# EAGLE design Arduino-Esplora-06 (EAGLE 6.4)
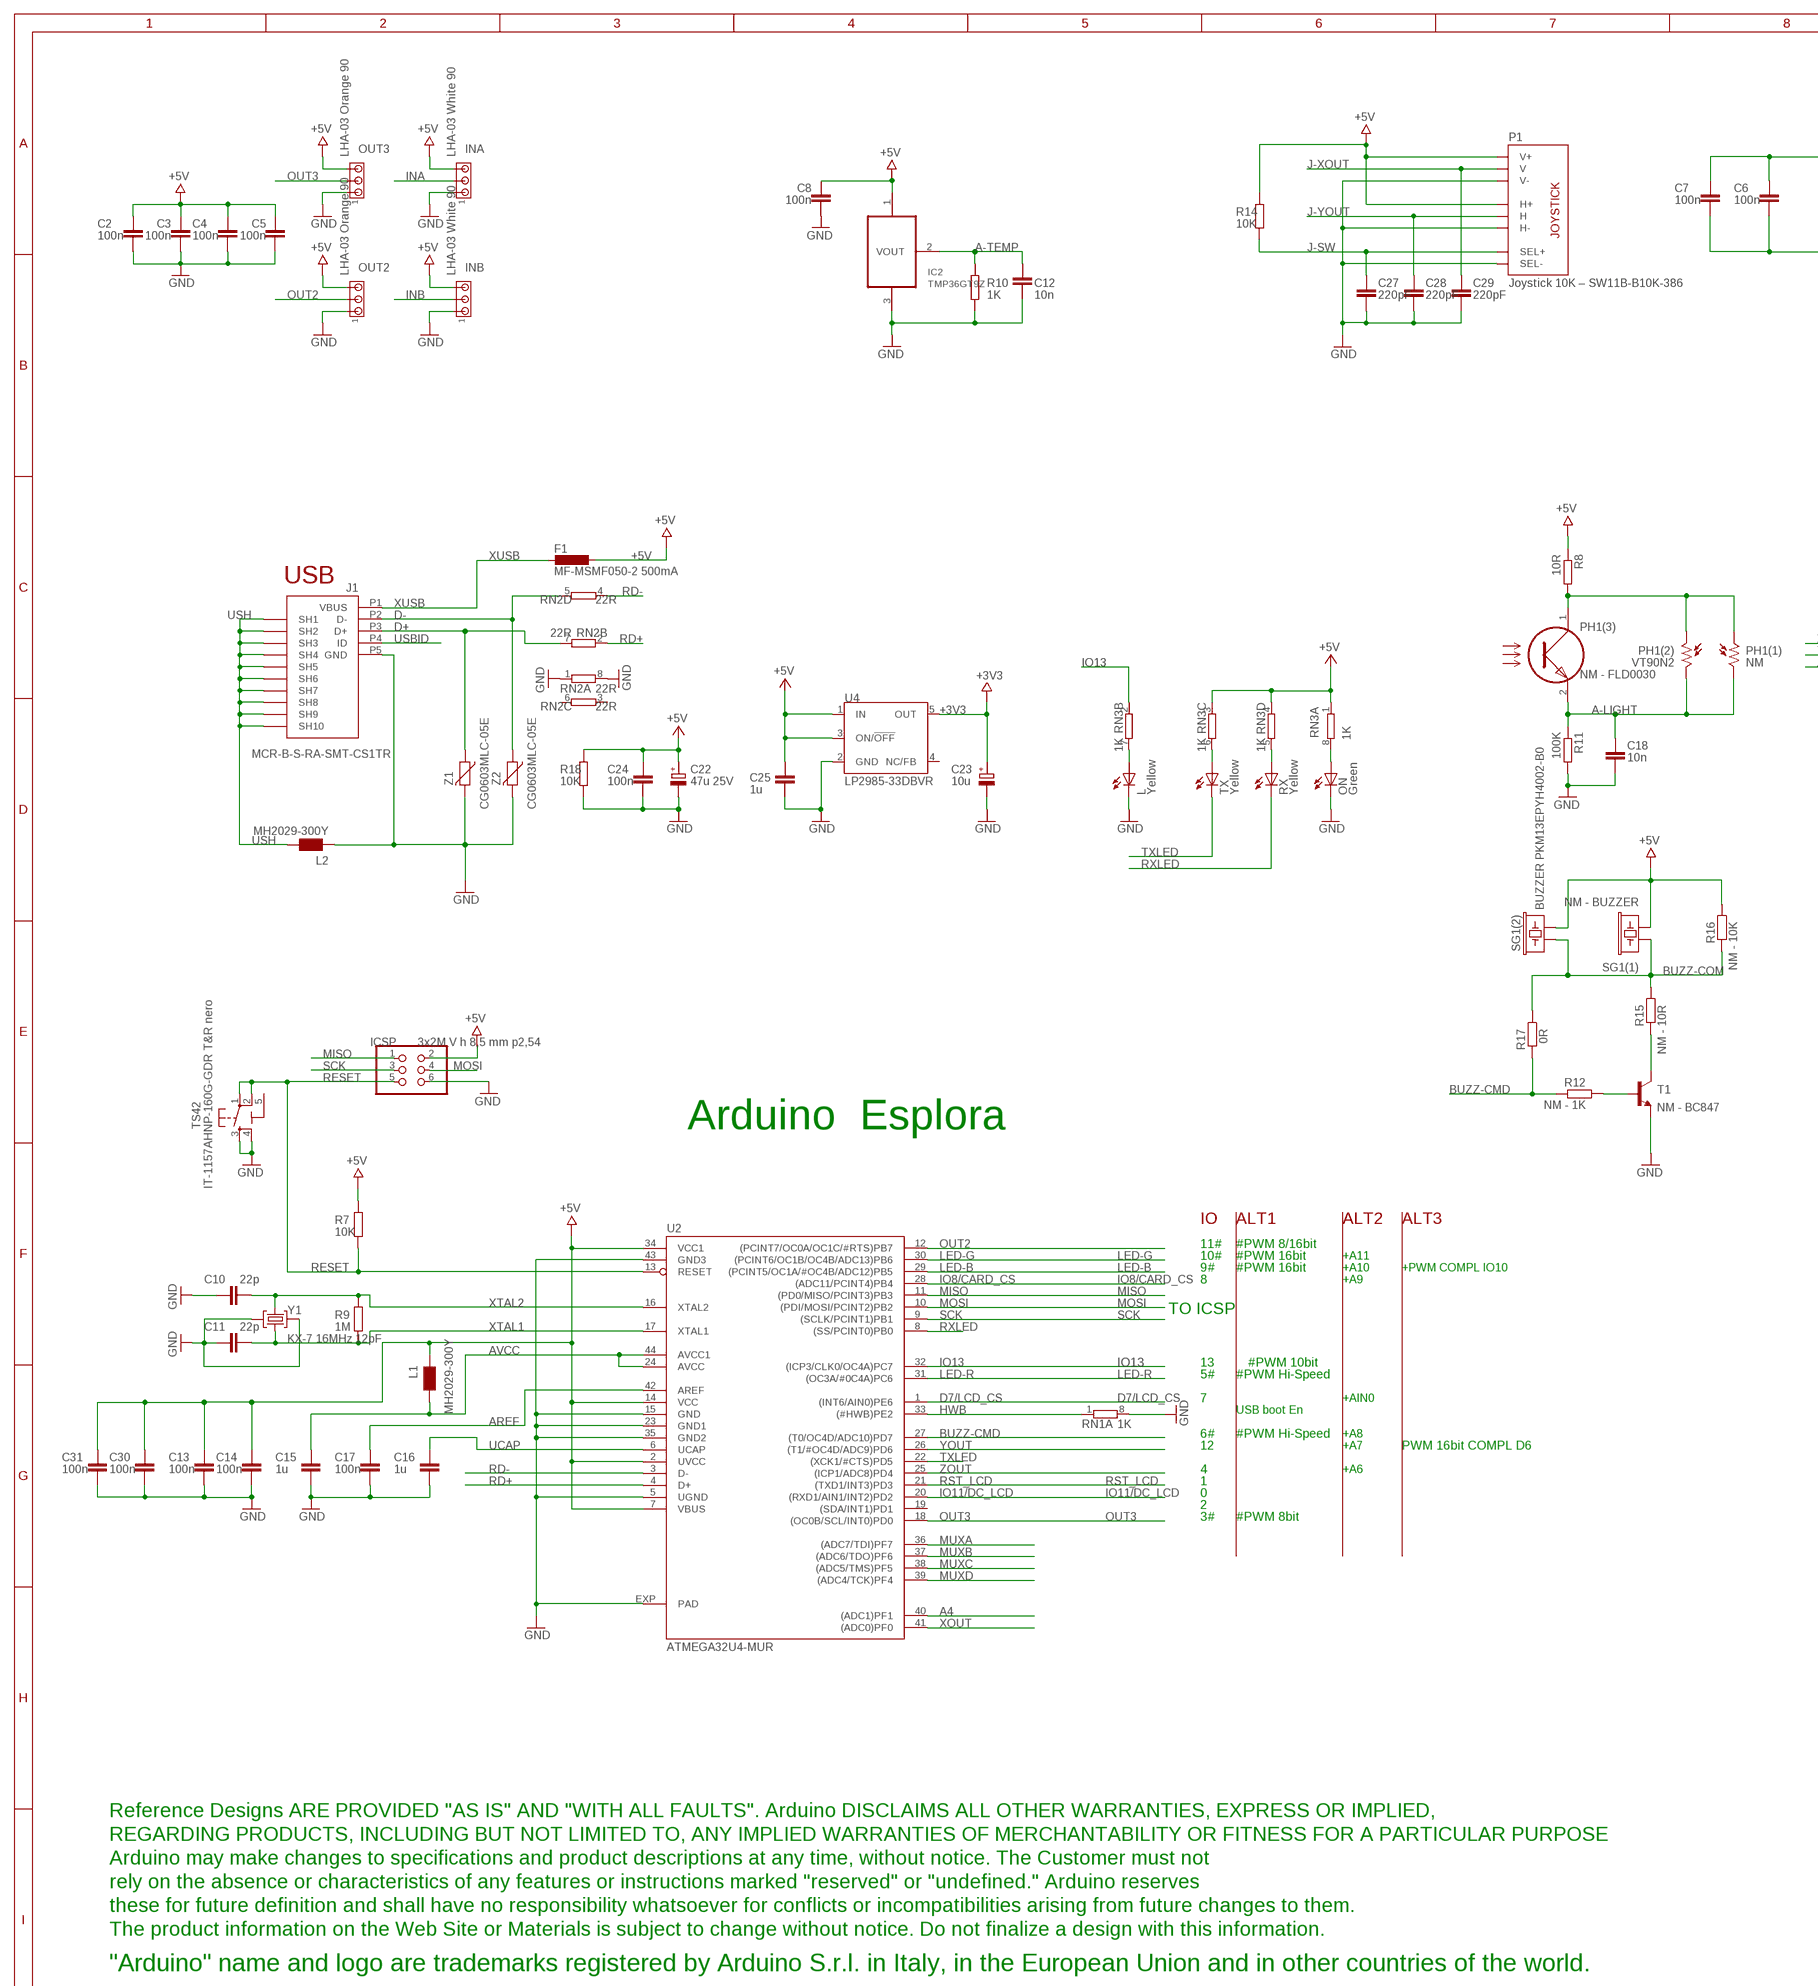
[diagram p0: schematic, sheet 1, part 1 of 2]
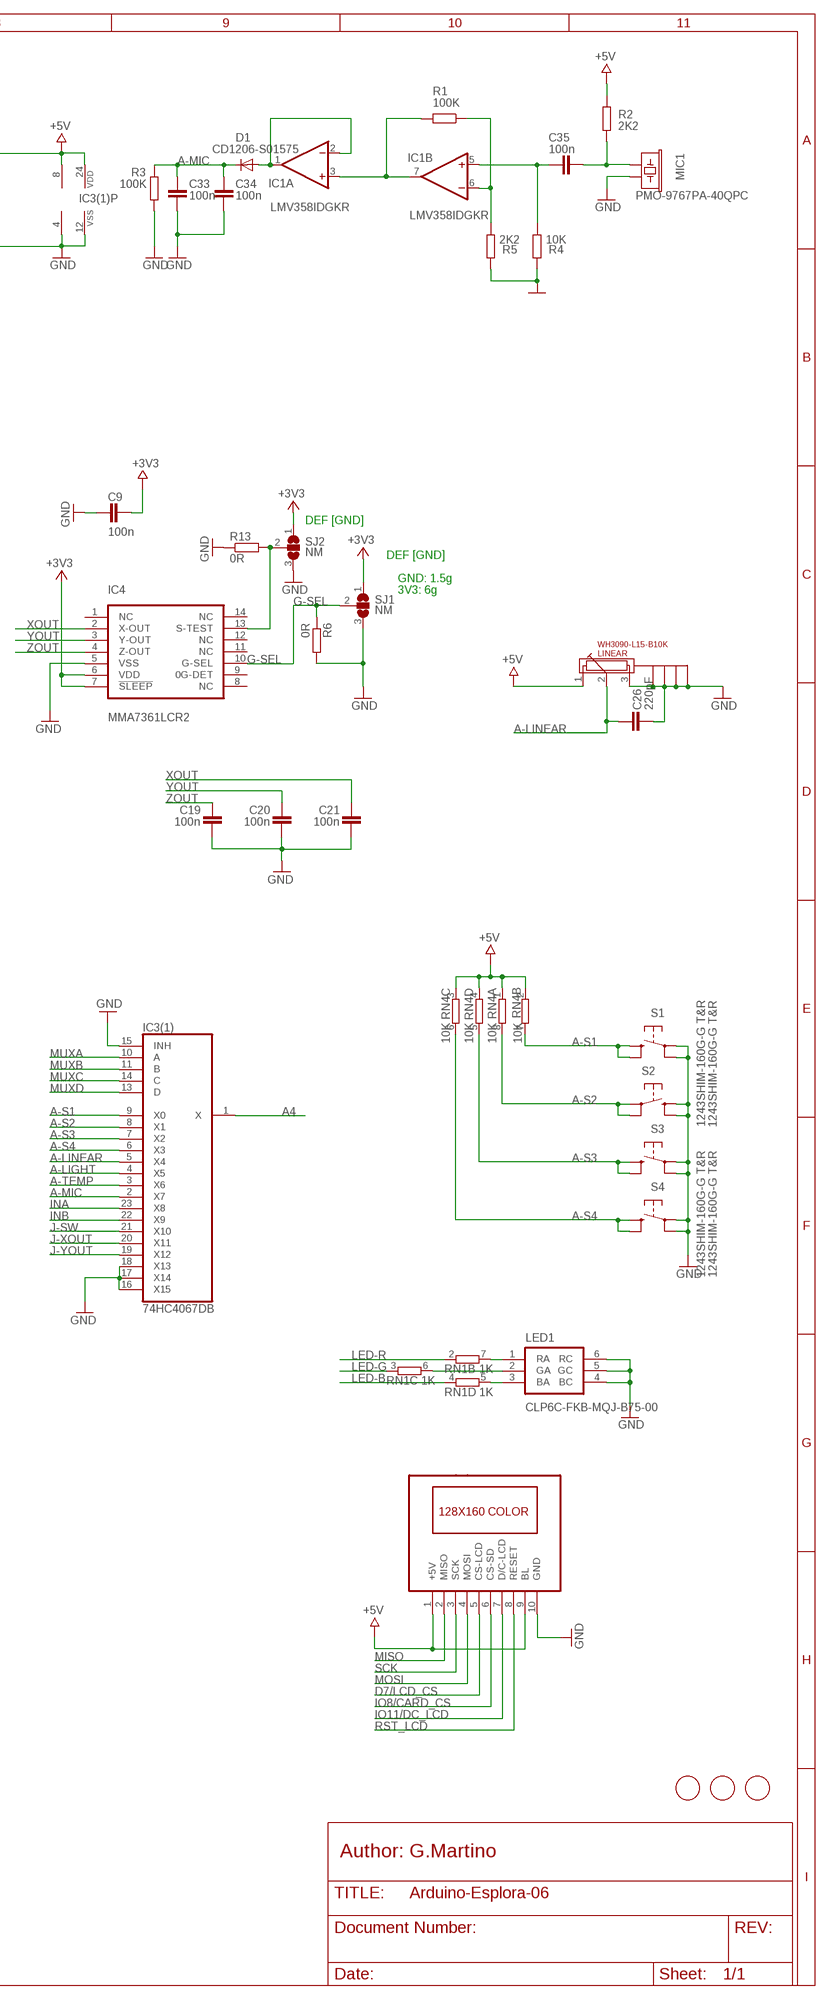
[diagram p1: schematic, sheet 1, part 2 of 2]

## Parts
C2  100n  C-EUC0603  [C0603-ROUND]
C3  100n  C-EUC0603  [C0603-ROUND]
C4  100n  C-EUC0603  [C0603-ROUND]
C5  100n  C-EUC0603  [C0603-ROUND]
C6  100n  C-EUC0603  [C0603-ROUND]
C7  100n  C-EUC0603  [C0603-ROUND]
C8  100n  C-EUC0603  [C0603-ROUND]
C9  100n  C-EUC0603  [C0603-ROUND]
C10  22p  C-EUC0603  [C0603-ROUND]
C11  22p  C-EUC0603  [C0603-ROUND]
C12  10n  C-EUC0603  [C0603-ROUND]
C13  100n  C-EUC0603  [C0603-ROUND]
C14  100n  C-EUC0603  [C0603-ROUND]
C15  1u  C-EUC0603  [C0603-ROUND]
C16  1u  C-EUC0603  [C0603-ROUND]
C17  100n  C-EUC0603  [C0603-ROUND]
C18  10n  C-EUC0603  [C0603-ROUND]
C19  100n  C-EUC0603  [C0603-ROUND]
C20  100n  C-EUC0603  [C0603-ROUND]
C21  100n  C-EUC0603  [C0603-ROUND]
C22  47u 25V  CPOL-EUD  [PANASONIC_D]
C23  10u  CPOL-EUSMCB  [SMC_B]
C24  100n  C-EUC0603  [C0603-ROUND]
C25  1u  C-EUC0603  [C0603-ROUND]
C26  220pF  C-EUC0603  [C0603-ROUND]
C27  220pF  C-EUC0603  [C0603-ROUND]
C28  220pF  C-EUC0603  [C0603-ROUND]
C29  220pF  C-EUC0603  [C0603-ROUND]
C30  100n  C-EUC0603  [C0603-ROUND]
C31  100n  C-EUC0603  [C0603-ROUND]
C33  100n  C-EUC0603  [C0603-ROUND]
C34  100n  C-EUC0603  [C0603-ROUND]
C35  100n  C-EUC0603  [C0603-ROUND]
D1  CD1206-S01575  DIODE-MINIMELF  [MINIMELF]
F1  MF-MSMF050-2 500mA  L-EUL1812  [L1812]
FID1  FIDUCIALMOUNT  [FIDUCIA-MOUNT]
FID2  FIDUCIALMOUNT  [FIDUCIA-MOUNT]
FID3  FIDUCIALMOUNT  [FIDUCIA-MOUNT]
IC1  LMV358IDGKR  LMV358MMX  [MSOP08]
IC2  TMP36GT9Z  LM35TO-92  [TO92]
IC3(1)  74HC4067DB  4067SM96  [SSOP24(0.65)]
IC4  MMA7361LCR2  MMA7361LC  [LGA-14_3X5/0.8]
ICSP  3x2M V h 8,5 mm p2,54  PINHD-2X3  [2X03]
INA  LHA-03 White 90  MTA03-100  [10X03MTA]
INB  LHA-03 White 90  MTA03-100  [10X03MTA]
J1  MCR-B-S-RA-SMT-CS1TR  MYCON2_USB-MINI-B  [CON2_USB_MICRO_B_AT]
L  Yellow  LEDCHIPLED_0805  [CHIPLED_0805]
L1  MH2029-300Y  WE-CBF_0805  [0805]
L2  MH2029-300Y  WE-CBF_0805  [0805]
LCD1  LCD1  1.8'_LCD-TFT(128X160)+SD-CARD  [1.8'_LCD-LCD-TFT(128X160)]
LED1  CLP6C-FKB-MQJ-B75-00  RGB-LED  [RGB-LED]
LINEAR  WH3090-L15-B10K  RA3021-202  [RA3021-202]
MIC1  PMO-9767PA-40QPC  MIC9.7MM  [MIC-9.7MM]
ON  Green  LEDCHIPLED_0805  [CHIPLED_0805]
OUT2  LHA-03 Orange 90  MTA03-100  [10X03MTA]
OUT3  LHA-03 Orange 90  MTA03-100  [10X03MTA]
P1  Joystick 10K – SW11B-B10K-386  ALP_JOYSTICKPTH  [ALP_JOYSTICK]
PH1(1)  NM  A1050_09  [T0-46-A10XX]
PH1(2)  VT90N2  B1060_23  [TO-8_B10]
PH1(3)  NM - FLD0030  FLD00030  [FLD00030]
R1  100K  R-EU_R0603  [R0603-ROUND]
R2  2K2  R-EU_R0603  [R0603-ROUND]
R3  100K  R-EU_R0603  [R0603-ROUND]
R4  10K  R-EU_R0603  [R0603-ROUND]
R5  2K2  R-EU_R0603  [R0603-ROUND]
R6  0R  R-EU_R0603  [R0603-ROUND]
R7  10K  R-EU_R0603  [R0603-ROUND]
R8  10R  R-EU_R0603  [R0603-ROUND]
R9  1M  R-EU_R0603  [R0603-ROUND]
R10  1K  R-EU_R0603  [R0603-ROUND]
R11  100K  R-EU_R0603  [R0603-ROUND]
R12  NM - 1K  R-EU_R0603  [R0603-ROUND]
R13  0R  R-EU_R0603  [R0603-ROUND]
R14  10K  R-EU_R0603  [R0603-ROUND]
R15  NM - 10R  R-EU_R0603  [R0603-ROUND]
R16  NM - 10K  R-EU_R0603  [R0603-ROUND]
R17  0R  R-EU_R0603  [R0603-ROUND]
R18  10K  R-EU_R0603  [R0603-ROUND]
RN1  1K  4R-NCAY16  [CAY16]
RN2  22R  4R-NCAY16  [CAY16]
RN3  1K  4R-NCAY16  [CAY16]
RN4  10K  4R-NCAY16  [CAY16]
RX  Yellow  LEDCHIPLED_0805  [CHIPLED_0805]
S1  1243SHIM-160G-G T&R  TACTILE_SWITCHTACTILE_SWITCH_SMD-12MM  [TACTILE-SMD-12MM]
S2  1243SHIM-160G-G T&R  TACTILE_SWITCHTACTILE_SWITCH_SMD-12MM  [TACTILE-SMD-12MM]
S3  1243SHIM-160G-G T&R  TACTILE_SWITCHTACTILE_SWITCH_SMD-12MM  [TACTILE-SMD-12MM]
S4  1243SHIM-160G-G T&R  TACTILE_SWITCHTACTILE_SWITCH_SMD-12MM  [TACTILE-SMD-12MM]
SG1(1)  NM - BUZZER  BUZZER1NS  [BUZZER-12MM-NS-P5MM]
SG1(2)  BUZZER PKM13EPYH4002-B0  BUZZER1PTH-NS-KIT  [BUZZER-12MM-NS-KIT]
SJ1  NM  SJ2W  [SJ_2]
SJ2  NM  SJ2W  [SJ_2]
T1  NM - BC847  BC847  [SOT23]
TS42  IT-1157AHNP-160G-GDR T&R nero  TS42  [TS42]
TX  Yellow  LEDCHIPLED_0805  [CHIPLED_0805]
U2  ATMEGA32U4-MUR  ATMEGA32U4-MU  [QFN44ML7X7]
U4  LP2985-33DBVR  LP2985-XXDBVR33  [SOT23-DBV]
U$19  DISCLAIMER  [DISCLAIMER]
Y1  KX-7 16MHz 12pF  CRYSTAL-3.2-2.5  [CRYSTAL-3.2-2.5]
Z1  CG0603MLC-05E  VARISTORCN0603  [CT/CN0603]
Z2  CG0603MLC-05E  VARISTORCN0603  [CT/CN0603]

## Nets
+3V3 [power]: C9.2 C23.+ IC4.6(VDD) IC4.7(!SLEEP) SJ1.1 SJ2.1 U4.5(OUT)
+5V [power]: C2.2 C3.2 C4.2 C5.2 C6.2 C7.2 C8.2 C13.1 C14.1 C22.+ C24.2 C25.2 C30.1 C31.1 F1.1 IC1.8(P:V+) IC2.1(+VS) IC3(1).24(VDD) ICSP.2 INA.3 INB.3 L1.1 LCD1.1(+5V) LCD1.9(BL) LINEAR.1 OUT2.3 OUT3.3 P1.H1(H+) P1.V1(V+) R2.1 R7.1 R8.1 R14.1 R16.1 R18.1 RN3.1 RN3.3 RN3.4 RN4.1 RN4.2 RN4.3 RN4.4 SG1(1).- SG1(2).- U2.2(UVCC) U2.7(VBUS) U2.14(VCC) U2.34(VCC1) U4.1(IN) U4.3(ON/!OFF)
A4: IC3(1).1(X) U2.40((ADC1)PF1)
A-LIGHT: C18.2 IC3(1).4(X5) PH1(1).2 PH1(2).2 PH1(3).2 R11.1
A-LINEAR: C26.2 IC3(1).5(X4) LINEAR.2
A-MIC: C33.2 C34.2 D1.C IC3(1).2(X7) R3.1
A-S1: IC3(1).9(X0) RN4.7 S1.P$3 S1.P$4
A-S2: IC3(1).8(X1) RN4.8 S2.P$1 S2.P$2
A-S3: IC3(1).7(X2) RN4.5 S3.P$3 S3.P$4
A-S4: IC3(1).6(X3) RN4.6 S4.P$3 S4.P$4
A-TEMP: C12.2 IC2.2(VOUT) IC3(1).3(X6) R10.1
AREF [aref]: C17.2 U2.42(AREF)
AVCC: C15.1 L1.2 U2.24(AVCC) U2.44(AVCC1)
BUZZ-CMD: R12.2 R17.2 U2.27((T0/OC4D/ADC10)PD7)
BUZZ-COM: R15.1 R16.2 R17.1 SG1(1).+ SG1(2).+
D7/LCD_CS: LCD1.5(CS-LCD) U2.1((INT6/AIN0)PE6)
D+: J1.P3(D+) RN2.7 Z1.1
D-: J1.P2(D-) RN2.5 Z2.1
G-SEL: IC4.10(G-SEL) R6.1 SJ1.2
GND [gnd]: C2.1 C3.1 C4.1 C5.1 C6.1 C7.1 C8.1 C9.1 C10.1 C11.2 C12.1 C13.2 C14.2 C15.2 C16.2 C17.1 C18.1 C19.1 C20.1 C21.1 C22.- C23.- C24.1 C25.1 C26.1 C27.1 C28.1 C29.1 C30.2 C31.2 C33.1 C34.1 IC1.4(P:V-) IC2.3(GND) IC3(1).12(VSS) IC3(1).15(INH) IC3(1).16(X15) IC3(1).17(X14) IC3(1).18(X13) IC4.5(VSS) ICSP.6 INA.1 INB.1 J1.P5(GND) L2.1 L.C LCD1.10(GND) LED1.4(BC) LED1.5(GC) LED1.6(RC) LINEAR.3 LINEAR.CHASSIS1(CHASSIS-GND-1) LINEAR.CHASSIS2(CHASSIS-GND-2) LINEAR.CHASSIS3(CHASSIS-GND-3) LINEAR.CHASSIS4(CHASSIS-GND-4) MIC1.2 ON.C OUT2.1 OUT3.1 P1.B2A(SEL-) P1.H3(H-) P1.V3(V-) R3.2 R4.2 R5.2 R6.2 R10.2 R11.2 R13.1 R18.2 RN1.8 RN2.1 RN2.8 S1.P$1 S1.P$2 S2.P$3 S2.P$4 S3.P$1 S3.P$2 S4.P$1 S4.P$2 SJ1.3 SJ2.3 T1.2(E) TS42.3 TS42.4 U2.5(UGND) U2.15(GND) U2.23(GND1) U2.35(GND2) U2.43(GND3) U2.EXP(PAD) U4.2(GND) Y1.2(GND) Y1.4(GND) Z1.2 Z2.2
HWB: RN1.1 U2.33((#HWB)PE2)
INA: IC3(1).23(X8) INA.2
INB: IC3(1).22(X9) INB.2
IO8/CARD_CS: LCD1.6(CS-SD) U2.28((ADC11/PCINT4)PB4)
IO11/DC_LCD: LCD1.7(D/C-LCD) U2.20((RXD1/AIN1/INT2)PD2)
IO13: RN3.2 U2.32((ICP3/CLK0/OC4A)PC7)
J-SW: C27.2 IC3(1).21(X10) P1.B1A(SEL+) R14.2
J-XOUT: C29.2 IC3(1).20(X11) P1.V2(V)
J-YOUT: C28.2 IC3(1).19(X12) P1.H2(H)
LED-B: RN1.4 U2.29((PCINT5/OC1A/#OC4B/ADC12)PB5)
LED-G: RN1.3 U2.30((PCINT6/OC1B/OC4B/ADC13)PB6)
LED-R: RN1.2 U2.31((OC3A/#0C4A)PC6)
MISO: ICSP.1 LCD1.2(MISO) U2.11((PD0/MISO/PCINT3)PB3)
MOSI: ICSP.4 LCD1.4(MOSI) U2.10((PDI/MOSI/PCINT2)PB2)
MUXA: IC3(1).10(A) U2.36((ADC7/TDI)PF7)
MUXB: IC3(1).11(B) U2.37((ADC6/TDO)PF6)
MUXC: IC3(1).14(C) U2.38((ADC5/TMS)PF5)
MUXD: IC3(1).13(D) U2.39((ADC4/TCK)PF4)
N$1: D1.A IC1.1(A:OUT) IC1.2(A:-IN)
N$2: L.A RN3.7
N$3: ON.A RN3.8
N$4: IC4.13(S-TEST) R13.2 SJ2.2
N$5: R15.2 T1.3(C)
N$6: RN3.6 TX.A
N$8: RN3.5 RX.A
N$11: LED1.1(RA) RN1.7
N$12: LED1.2(GA) RN1.6
N$13: LED1.3(BA) RN1.5
N$19: C35.1 MIC1.1 R2.2
N$20: C35.2 IC1.5(B:+IN) R4.1
N$21: IC1.6(B:-IN) R1.1 R5.1
N$23: IC1.3(A:+IN) IC1.7(B:OUT) R1.2
N$27: PH1(1).1 PH1(2).1 PH1(3).1 R8.2
N$31: R12.1 T1.1(B)
OUT2: OUT2.2 U2.12((PCINT7/OC0A/OC1C/#RTS)PB7)
OUT3: OUT3.2 U2.18((OC0B/SCL/INT0)PD0)
RD+: RN2.2 U2.4(D+)
RD-: RN2.4 U2.3(D-)
RESET: ICSP.5 R7.2 TS42.1 TS42.2 U2.13(RESET)
RST_LCD: LCD1.8(RESET) U2.21((TXD1/INT3)PD3)
RXLED: RX.C U2.8((SS/PCINT0)PB0)
SCK: ICSP.3 LCD1.3(SCK) U2.9((SCLK/PCINT1)PB1)
TXLED: TX.C U2.22((XCK1/#CTS)PD5)
UCAP: C16.1 U2.6(UCAP)
USBID: J1.P4(ID)
USH [gnd]: J1.P$1(SH7) J1.P$2(SH8) J1.P$3(SH9) J1.P$4(SH10) J1.P$5(SH7) J1.P$6(SH8) J1.P$7(SH9) J1.P$8(SH10) J1.S1(SH1) J1.S2(SH2) J1.S3(SH3) J1.S4(SH4) J1.S5(SH5) J1.S6(SH6) L2.2
XOUT: C21.2 IC4.2(X-OUT) U2.41((ADC0)PF0)
XTAL1: C11.1 R9.1 U2.17(XTAL1) Y1.1(C1)
XTAL2: C10.2 R9.2 U2.16(XTAL2) Y1.3(C2)
XUSB [usbvcc]: F1.2 J1.P1(VBUS)
YOUT: C20.2 IC4.3(Y-OUT) U2.26((T1/#OC4D/ADC9)PD6)
ZOUT: C19.2 IC4.4(Z-OUT) U2.25((ICP1/ADC8)PD4)
Unconnected: IC4.1(NC) IC4.8(NC) IC4.9(0G-DET) IC4.11(NC) IC4.12(NC) IC4.14(NC) RN2.3 RN2.6 U2.19((SDA/INT1)PD1) U4.4(NC/FB)

## Notes on the sheet
- DEF [GND]
- DEF [GND]
- USB
- GND: 1.5g
- 3V3: 6g
- Arduino  Esplora
- IO | ALT1 | ALT2 | ALT3
- 11# | #PWM 8/16bit
- 10# | #PWM 16bit | +A11
- 9# | #PWM 16bit | +A10 | +PWM COMPL IO10
- 8 | +A9
- TO ICSP
- 13 | #PWM 10bit
- 5# | #PWM Hi-Speed
- 7 | +AIN0
- USB boot En
- 6# | #PWM Hi-Speed | +A8
- 12 | +A7 | PWM 16bit COMPL D6
- 4 | +A6
- 1
- 0
- 2
- 3# | #PWM 8bit
- Author: G.Martino

## Power pins joined to a net without a drawn wire
5-GND: TS42.5(5-GND)

## Library data of the parts
C2-C21 C24-C31 C33-C35 = SmartPrj:C-EU: CAPACITOR, European symbol
C22 C23 = rcl:CPOL-EU: POLARIZED CAPACITOR, European symbol
D1 = diode:DIODE-: DIODE
F1 = rcl:L-EU: INDUCTOR, European symbol
FID1-FID3 = SmartPrj:FIDUCIALMOUNT
IC1 = linear:LMV358?*: Dual General Purpose, Low Voltage, Rail-to-Rail Output Operational Amplifiers Source: http://www.national.com/mpf/LM/LMV321.html http://www.national.com/dt/lmv_qual.pdf
IC2 = SmartPrj:LM35: LM35 Precision Centigrade Temperature Sensors
IC3(1) = SmartPrj:4067: 16-channel ANALOG MULTIPLEXER
IC4 = SmartPrj:MMA7361LC: MMA7361LC Three Axis Accelerometer Freescale Semiconductor
ICSP = SmartPrj:PINHD-2X3: PIN HEADER
INA INB OUT2 OUT3 = con-amp:MTA03-100: AMP connector
J1 = SmartPrj:MYCON2_USB-MINI-B
L ON RX TX = led:LED: LED OSRAM: - CHIPLED LG R971, LG N971, LY N971, LG Q971, LY Q971, LO R971, LY R971 LH N974, LH R974 LS Q976, LO Q976, LY Q976 LO Q996 - Hyper CHIPLED LW Q18S LB Q993, LB Q99A, LB R99A - SideLED LS A670, LO A670, LY A670, LG A670, LP A670 LB A673, LV A673, LT A673, LW A673 LH A674 LY A675 LS A676, LA A676, LO A676, LY A676, LW A676 LS A679, LY A679, LG A679 - Hyper Micro SIDELED® LS Y876, LA Y876, LO Y876, LY Y876 LT Y87S - SmartLED LW L88C, LW L88S LB L89C, LB L89S, LG L890 LS L89K, LO L89K, LY L89K LS L896, LA L896, LO L896, LY L896 - TOPLED LS T670, LO T670, LY T670, LG T670, LP T670 LSG T670, LSP T670, LSY T670, LOP T670, LYG T670 LG T671, LOG T671, LSG T671 LB T673, LV T673, LT T673, LW T673 LH T674 LS T676, LA T676, LO T676, LY T676, LB T676, LH T676, LSB T676, LW T676 LB T67C, LV T67C, LT T67C, LS T67K, LO T67K, LY T67K, LW E67C LS E67B, LA E67B, LO E67B, LY E67B, LB E67C, LV E67C, LT E67C LW T67C LS T679, LY T679, LG T679 LS T770, LO T770, LY T770, LG T770, LP T770 LB T773, LV T773, LT T773, LW T773 LH T774 LS E675, LA E675, LY E675, LS T675 LS T776, LA T776, LO T776, LY T776, LB T776 LHGB T686 LT T68C, LB T68C - Hyper Mini TOPLED® LB M676 - Mini TOPLED Santana® LG M470 LS M47K, LO M47K, LY M47K Source: http://www.osram.convergy.de LUXEON: - LUMILED® LXK2-PW12-R00, LXK2-PW12-S00, LXK2-PW14-U00, LXK2-PW14-V00 LXK2-PM12-R00, LXK2-PM12-S00, LXK2-PM14-U00 LXK2-PE12-Q00, LXK2-PE12-R00, LXK2-PE12-S00, LXK2-PE14-T00, LXK2-PE14-U00 LXK2-PB12-K00, LXK2-PB12-L00, LXK2-PB12-M00, LXK2-PB14-N00, LXK2-PB14-P00, LXK2-PB14-Q00 LXK2-PR12-L00, LXK2-PR12-M00, LXK2-PR14-Q00, LXK2-PR14-R00 LXK2-PD12-Q00, LXK2-PD12-R00, LXK2-PD12-S00 LXK2-PH12-R00, LXK2-PH12-S00 LXK2-PL12-P00, LXK2-PL12-Q00, LXK2-PL12-R00 Source: www.luxeon.com KINGBRIGHT: KA-3528ASYC Source: www.kingbright.com
L1 L2 = wuerth-elektronik:WE-CBF: SMD EMI Suppression Ferrite Beads - excellent anti-EMI properties - low DCR - impedances till 3000 ohms - rated current up to 6 A
LCD1 = SmartPrj:1.8'_LCD-TFT(128X160)+SD-CARD: 1.8Inch LCD Display + SD Card SmartProjects.it
LED1 = SmartPrj:RGB-LED: CREE RGB-LED/PLCC6-SMD
LINEAR = st-mod v1.1:RA3021-202: RA3021-202 Linear Potentiometer P.C.B. single unit case-earthing mounting type Travel: 30mm
MIC1 = SparkFun:MIC: Microphone Omni-directional electret microphone. 9.7mm standard diameter.
P1 = SmartPrj:ALP_JOYSTICK: Thumb Joystick Joystick commonly found in PS2 controllers. Two pots and a select switch. Footprint proven. Spark Fun Electronics SKU : COM-09032
PH1(1) = photo-elements:A10: Sensor Robust Light Sensing Applications Outdoor Light Sensing Application Source: http://optoelectronics.perkinelmer.com/content/Datasheets/DTS_PhotocellsA1050.pdf
PH1(2) = photo-elements:?1060*: Sensor Street Light control Source: http://optoelectronics.perkinelmer.com/content/Datasheets/DTS_PhotocellsB1060.pdf
PH1(3) = SmartPrj:FLD00030: FLD00030 Analog Ambient Light Sensor FAIRCHILD Semiconductor
R1-R18 = SmartPrj:R-EU_: RESISTOR, European symbol
RN1-RN4 = resistor-dil:4R-N: Array Chip Resistor Source: RS Component / Phycomp
S1-S4 = SmartPrj:TACTILE_SWITCH: Momentary Switch Button commonly used for reset or general input.
SG1(1) SG1(2) = SmartPrj:BUZZER1: Buzzer 12-22mm Spark Fun Electronics SKU : Comp-Buzzer
SJ1 SJ2 = jumper:SJ2W: SMD solder JUMPER
T1 = transistor:BC847: NPN TRANSISTOR
TS42 = SmartPrj:TS42: TS42 Dongnan Electronics Tact switch VDC 12V - 50mA
U2 = SmartPrj:ATMEGA32U4-
U4 = SmartPrj:LP2985-XXDBVR: ULTRALOW-POWER 50-mA LOW-DROPOUT LINEAR REGULATORS 50-mA Low-Dropout Regulator Source: http://focus.ti.com/lit/ds/symlink/tps77001.pdf
U$19 = Misc:DISCLAIMER
Y1 = SmartPrj:CRYSTAL-3.2-2.5
Z1 Z2 = varistor:VARISTOR: VARISTOR

## Net classes
0 default: width 0.254 mm, drill 0.61 mm, clearance 0.254 mm
1 power: width 0.254 mm, drill 0.61 mm, clearance 0.254 mm
2 gnd: width 0.254 mm, drill 0.61 mm, clearance 0.254 mm
3 usbvcc: width 0.254 mm, drill 0.61 mm, clearance 0.254 mm
4 aref: width 0.254 mm, drill 0.61 mm, clearance 0.254 mm

## Board
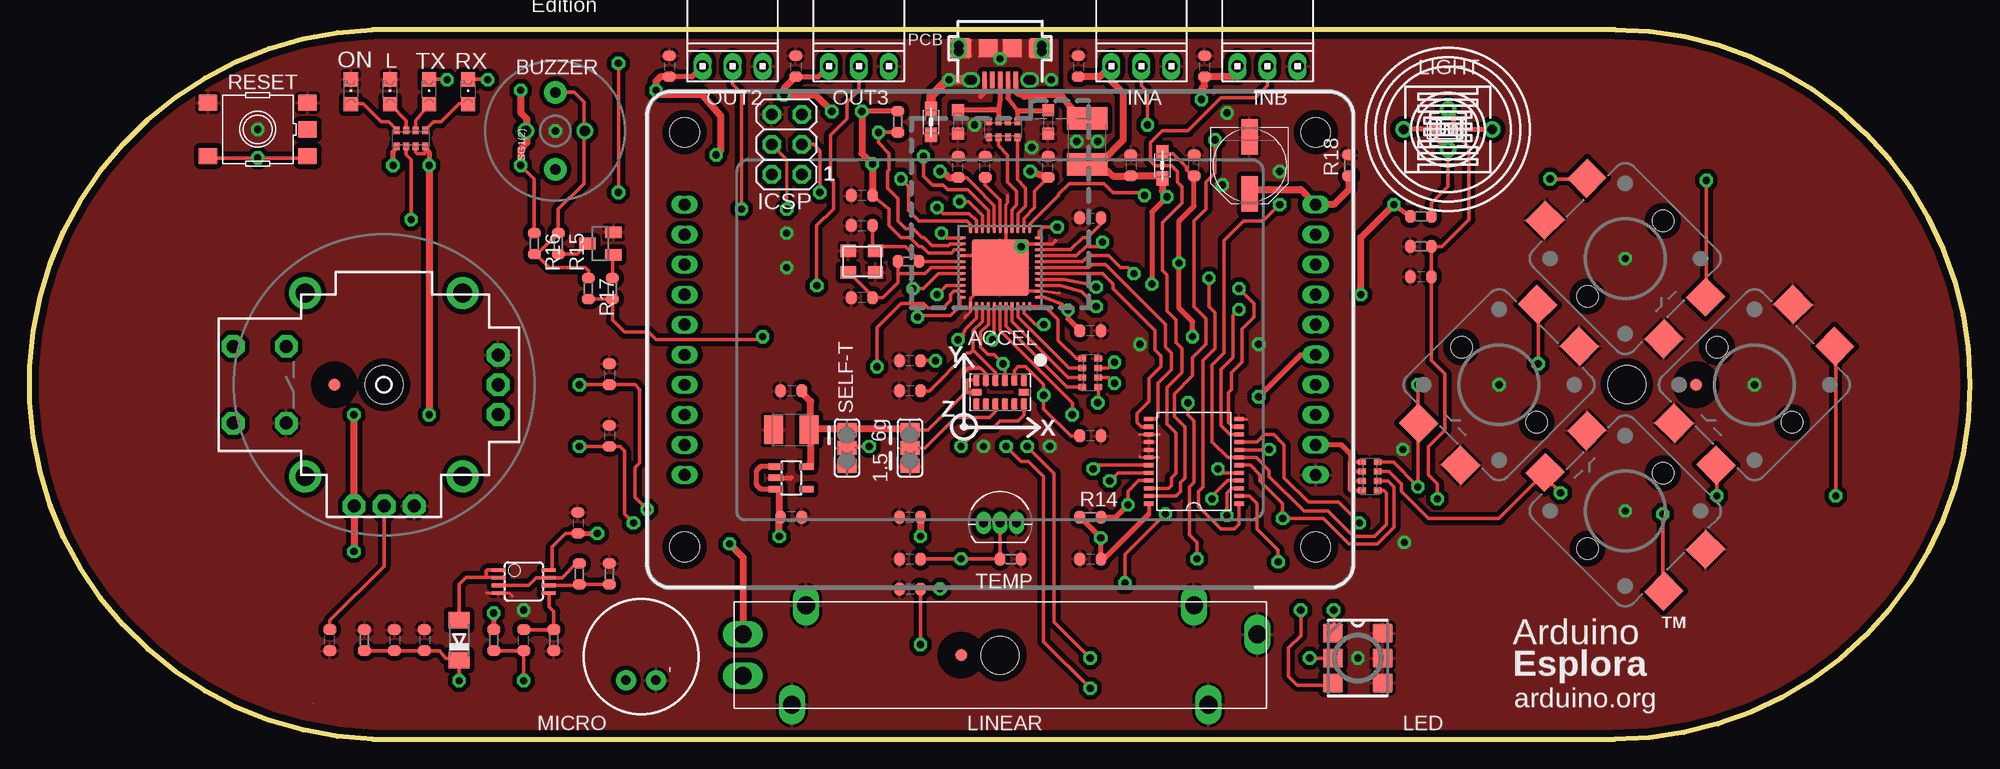
[diagram p2: board, top side]
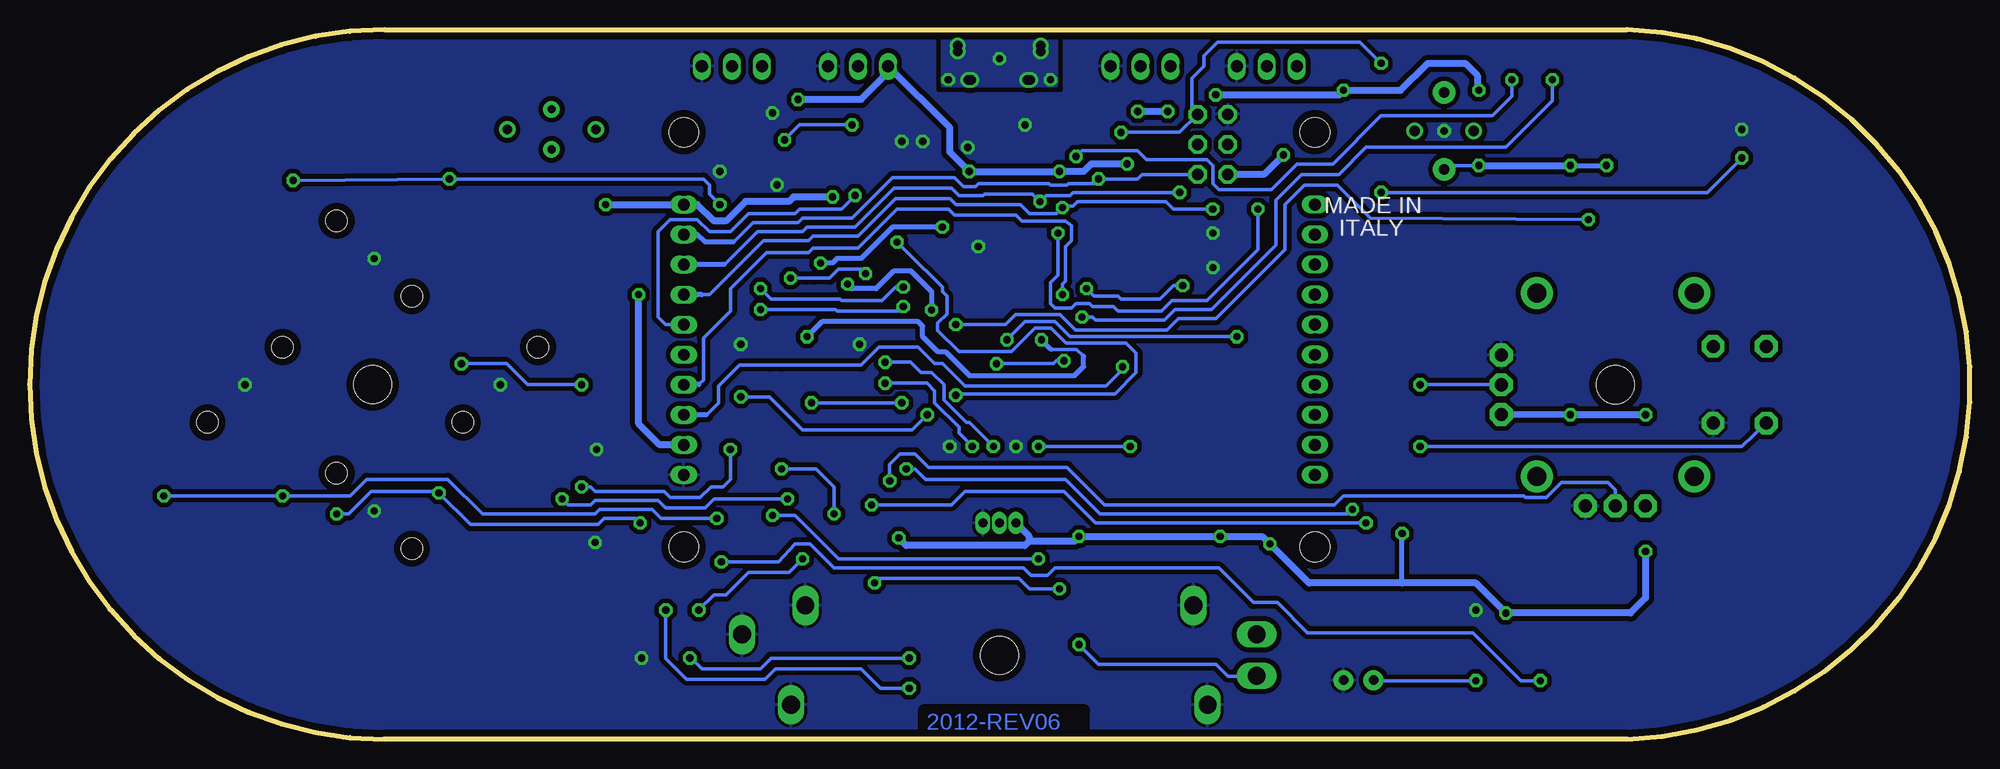
[diagram p3: board, bottom side, seen from below]

Size 163.98 x 60 mm. Coordinates in mm from the lower left corner, seen from the top.
Outline: 28.98,0 133.98,0 arc180 133.98,60 28.98,60 arc176 28.98,0
Copper layers (1*16): Top 0.035mm / dielectric 1.5mm / Bottom 0.035mm
Design rules "default": minimum track width 10mil, minimum drill 22mil, track to track 10mil, track to pad 10mil, pad to pad 8mil, via to via 12mil, smd to smd 8mil, copper to edge 24mil, drill to drill 12mil, minimum pad ring 10mil, minimum via ring 10mil, stop-mask expansion 2mil, vias tented up to drill 30mil, thermal gap 10mil
Holes 3.2 mm at 82.02,7.11 29.95,29.97 134.98,30
bRestrict: 3 lines
vRestrict: area 47.9,10.3 to 48.5,10.8; area 50.4,10.2 to 50.9,11

### Footprints (pad centres in the part's own frame; a part is rotated, then mirrored left to right if it is on the bottom)
C0603-ROUND = smd 0.898 x 1.1: 1 -0.889,0; 2 0.889,0
PANASONIC_D = smd 3 x 1.4: + 2.4,0; - -2.4,0
SMC_B = smd 1.6 x 2.4: + -1.5,0; - 1.5,0
MINIMELF = smd 1.4 x 1.8: A 1.7,0; C -1.7,0
L1812 = smd 1.9 x 3.4: 1 -1.95,0; 2 1.95,0
FIDUCIA-MOUNT = smd 1.016 x 1.016: P$1 0,0
MSOP08 = smd 0.3 x 1.2: 1 -0.976,-2.113; 2 -0.326,-2.113; 3 0.324,-2.113; 4 0.974,-2.113; 5 0.974,2.112; 6 0.324,2.112; 7 -0.326,2.112; 8 -0.976,2.112
TO92 = drill 0.75 pad 1.092 long: 1 -1.397,0; 2 0,0; 3 1.397,0
SSOP24(0.65) = smd 0.35 x 0.8: 1 -3.575,-3.81; 2 -2.925,-3.81; 3 -2.275,-3.81; 4 -1.625,-3.81; 5 -0.975,-3.81; 6 -0.325,-3.81; 7 0.325,-3.81; 8 0.975,-3.81; 9 1.625,-3.81; 10 2.275,-3.81; 11 2.925,-3.81; 12 3.575,-3.81; 13 3.575,3.81; 14 2.925,3.81; 15 2.275,3.81; 16 1.625,3.81; 17 0.975,3.81; 18 0.325,3.81; 19 -0.325,3.81; 20 -0.975,3.81; 21 -1.625,3.81; 22 -2.275,3.81; 23 -2.925,3.81; 24 -3.575,3.81
LGA-14_3X5/0.8 = smd 0.55 x 0.9: 1 -2,-1; 3 -0.4,-1; 4 0.4,-1; 5 1.2,-1; 6 2,-1; 8 2,1; 9 1.2,1; 10 0.4,1; 11 -0.4,1; 12 -1.2,1; 13 -2,1 | smd 0.55 x 0.85: 2 -1.2,-1 | smd 0.9 x 0.55: 7 2,0; 14 -2,0
2X03 = drill 0.95 pad 1.55 octagon: 1 -2.54,-1.27; 2 -2.54,1.27; 3 0,-1.27; 4 0,1.27; 5 2.54,-1.27; 6 2.54,1.27
10X03MTA = drill 1.016 long: 1 2.54,0; 2 0,0; 3 -2.54,0
CON2_USB_MICRO_B_AT = smd 0.406 x 1.346: P1 -1.321,2.692; P2 -0.66,2.692; P3 0,2.692; P4 0.66,2.692; P5 1.321,2.692 | drill 0.8 pad 1.24: P$1 -2.616,2.692; P$2 -2.362,2.692; P$7 2.362,2.692; P$8 2.616,2.692 | drill 0.8 pad 1.25: P$3 -3.505,-0.254; P$4 -3.505,0.254; P$5 3.505,0.254; P$6 3.505,-0.254 | smd 1.778 x 1.651: S1 -3.302,0; S2 3.302,0 | smd 1.524 x 1.27: S3 -2.489,2.692; S4 2.489,2.692 | smd 1.626 x 1.524: S5 -1.016,0; S6 1.016,0
CHIPLED_0805 = smd 1.2 x 1.2: A 0,-1.05; C 0,1.05
0805 = smd 1.2 x 1: 1 -1.1,0; 2 1.1,0
1.8'_LCD-LCD-TFT(128X160) = drill 1 long: 1 11.43,-26.67; 2 8.89,-26.67; 3 6.35,-26.67; 4 3.81,-26.67; 5 1.27,-26.67; 6 -1.27,-26.67; 7 -3.81,-26.67; 8 -6.35,-26.67; 9 -8.89,-26.67; 10 -11.43,-26.67; 11 11.43,26.67; 12 8.89,26.67; 13 6.35,26.67; 14 3.81,26.67; 15 1.27,26.67; 16 -1.27,26.67; 17 -3.81,26.67; 18 -6.35,26.67; 19 -8.89,26.67; 20 -11.43,26.67 | hole 2.5: -17.526,-26.67; 17.526,-26.67; 17.526,26.67; -17.526,26.67
RGB-LED = smd 1.7 x 1.55: 1 -2.1,2.1; 2 -2.1,0; 3 -2.1,-2.1; 4 2.1,-2.1; 5 2.1,0; 6 2.1,2.1
RA3021-202 = drill 1.5 long: 1 -21.75,1.75; 2 -21.75,-1.75; 3 21.75,1.75; CHASSIS1 -16.4,4.2; CHASSIS2 16.4,4.2; CHASSIS3 -17.6,-4.2; CHASSIS4 17.6,-4.2
MIC-9.7MM = drill 0.8 pad 1.676: 1 -2,1.27; 2 -2,-1.27
ALP_JOYSTICK = drill 1.1 pad 1.93 octagon: B1A -3.25,12.75; B1B 3.25,12.75; B2A -3.25,8.25; B2B 3.25,8.25; H1 -2.5,-9.65; H2 0,-9.65; H3 2.5,-9.65; V1 -10.25,2.54; V2 -10.25,0; V3 -10.25,-2.54 | drill 1.6 pad 2.7: MOUNT1 -7.75,6.65; MOUNT2 -7.75,-6.65; MOUNT3 7.75,-6.65; MOUNT4 7.75,6.65
T0-46-A10XX = drill 0.7 pad 1.4: 1 -1.7,0; 2 1.7,0
TO-8_B10 = drill 0.8 pad 1.4: 1 -3.75,0; 2 3.75,0
FLD00030 = smd 0.8 x 0.9: 1 -0.75,0; 2 0.75,0
R0603-ROUND = smd 0.898 x 1.1: 1 -0.889,0; 2 0.889,0
CAY16 = smd 0.5 x 0.65: 1 -1.2,-0.675; 2 -0.4,-0.675; 3 0.4,-0.675; 4 1.2,-0.675; 5 1.2,0.675; 6 0.4,0.675; 7 -0.4,0.675; 8 -1.2,0.675
TACTILE-SMD-12MM = smd 2.3 x 2.4: P$1 7.1,-2.5; P$2 -7.1,-2.5; P$3 7.1,2.5; P$4 -7.1,2.5 | hole 1.8: 0,4.5; 0,-4.5
BUZZER-12MM-NS-P5MM = drill 0.9: + 2.5,0; - -2.5,0
BUZZER-12MM-NS-KIT = drill 0.9 pad 1.88: + 3.25,0; - -3.25,0
SJ_2 = smd 1.168 x 1.6: 1 -1.524,0; 2 0,0; 3 1.524,0
SOT23 = smd 1 x 1.4: 1 -0.95,-1.1; 2 0.95,-1.1; 3 0,1.1
TS42 = smd 1.6 x 1.4: 1 -4.2,2.25; 2 4.2,2.25; 3 -4.2,-2.25; 4 4.2,-2.25; 5 -4.2,0
QFN44ML7X7 = smd 0.75 x 0.275: 1 -3.275,2.5; 2 -3.275,2; 3 -3.275,1.5; 4 -3.275,1; 5 -3.275,0.5; 6 -3.275,0; 7 -3.275,-0.5; 8 -3.275,-1; 9 -3.275,-1.5; 10 -3.275,-2; 11 -3.275,-2.5; 23 3.275,-2.5; 24 3.275,-2; 25 3.275,-1.5; 26 3.275,-1; 27 3.275,-0.5; 28 3.275,0; 29 3.275,0.5; 30 3.275,1; 31 3.275,1.5; 32 3.275,2; 33 3.275,2.5 | smd 0.275 x 0.75: 12 -2.5,-3.275; 13 -2,-3.275; 14 -1.5,-3.275; 15 -1,-3.275; 16 -0.5,-3.275; 17 0,-3.275; 18 0.5,-3.275; 19 1,-3.275; 20 1.5,-3.275; 21 2,-3.275; 22 2.5,-3.275; 34 2.5,3.275; 35 2,3.275; 36 1.5,3.275; 37 1,3.275; 38 0.5,3.275; 39 0,3.275; 40 -0.5,3.275; 41 -1,3.275; 42 -1.5,3.275; 43 -2,3.275; 44 -2.5,3.275 | smd 4.826 x 4.826: EXP 0,0
SOT23-DBV = smd 0.55 x 1.2: 1 -0.95,-1.3; 2 0,-1.3; 3 0.95,-1.3; 4 0.95,1.3; 5 -0.95,1.3
CRYSTAL-3.2-2.5 = smd 1.3 x 1.05: 1 -1.15,-0.925; 2 1.15,-0.925; 3 1.15,0.925; 4 -1.15,0.925
CT/CN0603 = smd 1 x 1: 1 -1,0; 2 1,0

### Placement (x,y rotation side)
C2  64.75,56.9 270 top
C3  54.08,56.9 270 top
C4  88.63,56.9 270 top
C5  99.29,56.9 270 top
C6  46.33,18.29 270 top
C7  89.64,15.24 0 top
C8  74.4,18.8 0 top
C9  64.37,29.46 0 top
C10  70.34,43.43 0 top
C11  70.34,37.34 180 top
C12  74.4,15.24 0 top
C13  89.64,34.54 0 top
C14  70.34,45.97 180 top
C15  98.4,48.51 90 top
C16  80.75,48.39 90 top
C17  89.64,44.07 0 top
C18  117.58,39.12 0 top
C19  74.4,29.46 0 top
C20  74.4,32 0 top
C21  89.64,25.65 180 top
C22  103.1,48.51 270 top
C23  64.37,26.16 180 top
C24  93.07,48.51 270 top
C25  64.37,18.8 180 top
C26  74.4,12.7 0 top
C27  49,25.65 270 top
C28  49,30.86 270 top
C29  25.38,8.38 90 top
C30  86.09,48.39 90 top
C31  78.47,48.39 90 top
C33  33.38,8.38 270 top
C34  30.84,8.38 270 top
C35  41.76,8.38 90 top
D1  36.3,8.38 90 top
F1  89.39,50.55 90 top
FID1  25.76,29.97 0 top
FID2  140.82,29.97 0 top
FID3  78.72,7.11 0 top
IC1  41.76,13.34 270 top
IC2  82.02,18.29 0 top
IC3(1)  98.4,23.5 90 top
IC4  82.02,29.34 180 top
ICSP  63.99,50.29 90 top
INA  93.96,56.9 0 top
INB  104.63,56.9 0 top
J1  82.02,58.42 180 top
L  30.46,54.74 0 top
L1  95.74,48.51 90 top
L2  76.18,52.2 90 top
LCD1  82.02,33.78 90 top
LED1  112.25,6.86 0 top
LINEAR  82.02,7.11 0 top
MIC1  51.67,6.99 90 top
ON  27.16,54.74 0 top
OUT2  59.42,56.9 0 top
OUT3  70.08,56.9 0 top
P1  29.95,29.97 90 top
PH1(1)  119.87,51.56 90 top
PH1(2)  119.87,51.56 0 top
PH1(3)  119.61,51.56 0 top
R1  46.46,13.97 90 top
R2  39.22,8.38 270 top
R3  28.3,8.38 90 top
R4  44.3,8.38 270 top
R5  49,13.97 90 top
R6  74.4,23.88 270 top
R7  73.39,52.2 270 top
R8  117.58,44.2 0 top
R9  74.27,40.39 0 top
R10  82.91,15.24 0 top
R11  117.58,41.66 180 top
R12  49.26,38.1 270 top
R13  69.07,23.88 90 top
R14  89.64,18.8 0 top
R15  44.68,41.91 270 top
R16  42.65,41.91 270 top
R17  47.22,38.1 270 top
R18  111.49,48.51 90 top
RN1  89.64,30.99 270 top
RN2  82.28,51.56 0 top
RN3  32.24,50.8 0 top
RN4  113.26,22.23 270 top
RX  37.06,54.74 0 top
S1  134.85,19.3 135 top
S2  124.19,29.97 225 top
S3  134.85,40.64 315 top
S4  145.78,29.97 225 top
SG1(1)  44.43,51.44 0 top
SG1(2)  44.43,51.44 90 top
SJ1  74.4,24.64 270 top
SJ2  69.07,24.64 270 top
T1  48.24,41.91 90 top
TS42  19.28,51.56 180 top
TX  33.76,54.74 0 top
U2  82.02,39.88 270 top
U4  64.37,22.1 270 top
U$19  -4.59,-22.61 0 top  (outside the outline)
Y1  70.34,40.39 0 top
Z1  78.47,52.2 270 top
Z2  86.09,52.2 270 top

### Tracks (layer width: path | path; a pad name or v marks a point on that pad's centre or on a via)
+3V3
  Top 0.279: IC4.6 80.01,30.35 79.23,30.35 79.23,29.34
  Top 0.305: SJ1.1 75.93,26.16 79.1,29.34 79.23,29.34 IC4.7
  Top 0.406: SJ2.1 69.58,26.16 69.58,26.29
  Top 0.61: 66.02,26.29 66.02,28.57 65.26,29.34 C9.2 | U4.5 66.02,23.24 66.02,25.91 C23.+ 66.02,26.29 | 66.02,26.29 69.58,26.29 74.27,26.29 SJ1.1
+5V  (via drill 0.61)
  Top 0.279: U2.34 85.68,37.38 87.25,36.78 v87.76,36.29 87.86,36.47 87.86,36.45 | U2.2 84.02,44.04 84.94,44.96 84.94,46.35 C30.1 86.21,47.5 | U2.7 81.52,45.1 80.78,45.85 80.57,46.1 79.18,47.5 C31.1 | U2.14 78.19,41.38 77.93,41.12 75.95,41.12 75.42,41.66 75.16,41.66 74.4,42.42 73.64,42.42 72.62,43.43 72.62,44.83 C14.1 | C13.1 88.63,34.67 | RN4.4 111.67,21.02 111.61,21.08 | RN4.1 111.8,23.43 | 111.8,23.43 111.61,23.37 111.61,23.36 111.8,23.43 | RN4.2 111.63,22.62 111.61,22.61 | RN4.3 111.72,21.82 111.61,21.72 | 42.02,51.44 SG1(1).- | 42.65,46.53 42.65,47.37 v41.51,48.51
  Top 0.305: C6.2 45.32,17.4 44.18,16.26 44.18,14.35 44.14,14.31 IC1.8 | RN3.3 32.64,49.64 32.75,49.53 33.38,49.53 33.44,49.59 RN3.4 | R16.1 42.65,46.53
  Top 0.356: IC3(1).24 94.59,19.05
  Top 0.406: v39.22,10.67 R2.1 | 63.35,20.95 U4.3 62.97,21.13 61.83,21.13 61.45,21.51 61.45,22.71 61.83,23.09 63,23.09 U4.1 | v30.71,48.51 30.71,49.66 RN3.1 | v33.76,48.51 33.76,49.66 RN3.4 | v115.3,45.21 R8.1 | 70.27,53.02 70.72,53.09 R7.1 | C2.2 66.65,56.01 OUT3.3 | OUT2.3 55.99,56.01 C3.2 | C24.2 93.2,47.37 | v94.85,38.48 94.85,44.58 v96.12,45.85 | 87.86,36.45 87.74,36.32 | 87.74,36.32 87.74,35.56 88.63,34.67 | v87.76,36.29 87.76,36.43 87.74,36.32 | C6.2 v47.99,17.4 | 111.61,21.08 111.61,21.72 111.61,22.61 111.61,23.36 | 111.61,23.37 111.61,24.13 110.85,24.89 LCD1.9 | R14.1 90.15,17.4 v90.53,17.02 C7.2 90.78,15.24 94.59,19.05 | C22.+
  Top 0.61: v27.41,15.88 P1.V1 v27.41,27.43 | 63.35,20.95 63.35,19.05 C25.2 63.35,18.67 v63.35,17.14 | C8.2 v75.29,17.14 | v59.16,16.51 60.3,15.37 60.3,9.14 LINEAR.1 | v41.51,54.86 41.51,52.96 42.02,52.45 42.02,51.44 42.02,50.42 41.51,49.91 v41.51,48.51 | C3.2 53.32,56.01 52.94,55.63 v52.94,54.86 53.26,54.55 56.81,54.55 58.4,52.7 58.4,49.78 v58.02,49.4 | 103.36,46.48 103.1,46.48 | 103.1,46.48 C22.+ | C14.1 v71.23,48.64 70.34,49.53 70.34,52.7 70.27,53.02 v70.34,53.09 | v76.94,48.01 77.2,48.01 77.7,47.5 C31.1 | INB.3 102.09,56.01 C5.2 99.29,55.24 99.04,54.99 v99.04,54.1 | INA.3 90.4,56.01 C4.2 | 89.9,48.77 F1.1 | INA.3 91.42,55.63 92.44,54.61 92.44,50.67 90.4,48.64 | 91.42,56.77 INA.3 | 88.37,48.39 88.75,48.77 89.51,48.77 F1.1 | C30.1 v84.56,48.01 | v96.12,45.85 95.74,46.35 L1.1 95.74,47.62 C24.2 91.55,47.62 90.4,48.64 | C2.2 63.73,54.99 v63.73,54.48 66.4,54.48 v67.8,53.09 | v33.76,48.51 v33.76,27.43 | 90.4,48.64 89.69,48.64 F1.1 | v112.5,37.59 112.5,42.42 v115.3,45.21 | 103.36,46.48 104.75,46.48 | 104.75,46.48 107.42,46.48 LCD1.1 110.22,45.21 111.49,46.48 R18.1 | 103.36,46.48 104.75,46.48 | 103.36,46.48 103.1,46.48 | C22.+ 102.85,46.74
  Bottom 0.279: 41.6,48.51 44.1,48.51 SG1(2).-
  Bottom 0.406: v33.76,48.51 v30.71,48.51 | v94.85,38.48 94.47,38.1 92.44,38.1 90.91,39.62 89.51,39.62 87.74,37.85 87.74,36.53 v87.76,36.29 | 47.99,13.21 v47.99,17.4 | v41.51,48.51 41.6,48.51
  Bottom 0.61: v27.41,15.88 27.41,11.94 28.68,10.67 v39.22,10.67 41.76,13.21 47.99,13.21 55.86,13.21 v59.16,16.51 59.8,17.14 v63.35,17.14 63.86,17.14 63.99,17.14 v75.29,17.14 75.67,16.76 79.48,16.76 | v27.41,27.43 v33.76,27.43 P1.H1 | v90.53,17.02 89.9,16.38 79.86,16.38 79.48,16.76 | v41.51,48.51 v33.76,48.51 | v58.02,49.4 59.67,47.75 ICSP.2 | v115.3,45.21 LCD1.1 107.55,45.21 106.15,43.81 105.14,43.81 103.48,45.47 | v71.23,48.64 74.27,48.64 74.91,48.01 v76.94,48.01 v84.56,48.01 86.21,49.66 86.21,51.69 INA.3 91.42,56.39 93.71,54.1 v99.04,54.1 | v70.34,53.09 v67.8,53.09 | v96.12,45.85 99.42,45.85 99.8,45.47 | LCD1.9 110.72,24.89 112.5,26.67 v112.5,37.59 | v63.73,54.48 53.32,54.48 v52.94,54.86 48.11,54.86 45.83,57.15 42.65,57.15 41.64,56.13 41.64,54.99 v41.51,54.86 | 99.8,45.47 103.48,45.47 | 79.48,16.76 79.48,17.14 IC2.1 | 99.8,45.47 103.48,45.47
A4  (via drill 0.61)
  Top 0.279: v93.32,39.37 92.82,39.88 92.18,39.88 91.17,40.89 89.51,40.89 89,40.38 U2.40 | v99.67,38.99 99.67,36.58 100.18,36.07 100.18,33.02 99.17,32 99.17,21.34 98.79,20.95 98.79,19.68 100.69,17.78 101.83,17.78 102.21,18.16 IC3(1).1
  Bottom 0.279: v93.32,39.37 93.71,39.75 95.61,39.75 96.37,38.99 97.64,38.99 98.28,38.99 v99.67,38.99
A-LIGHT  (via drill 0.61)
  Top 0.305: v118.98,20.32 118.98,21.59 118.22,22.35 118.22,24.77 119.61,26.16 119.61,30.86 118.47,32 C18.2 R11.1 119.36,41.66 121.65,43.94 121.65,50.04 120.36,51.32 PH1(3).2 | IC3(1).4 101.22,21.87 99.93,20.57 v99.93,20.32
  Top 0.406: PH1(1).2 120.36,52.77 PH1(3).2 PH1(2).2
  Bottom 0.305: v99.93,20.32 106.15,20.32 106.91,19.56 110.22,19.56 110.85,20.19 116.18,20.19 116.57,19.81 118.47,19.81 v118.98,20.32
A-LINEAR  (via drill 0.6, 0.61)
  Top 0.279: 100.78,22.52 v100.44,22.86
  Top 0.305: v75.29,8 C26.2 v76.94,12.7 | IC3(1).5 100.78,22.52 | v92.56,13.21 92.56,15.62 v95.99,19.05
  Bottom 0.305: v75.29,8 73.64,6.35 63.73,6.35 62.72,5.33 60.56,5.33 LINEAR.2 | v100.44,22.86 97.52,22.86 95.99,21.34 v95.99,19.05 | v76.94,12.7 79.48,12.7 80.37,13.59 92.18,13.59 v92.56,13.21
A-MIC  (via drill 0.61)
  Top 0.305: v105.52,14.99 105.52,16 103.74,17.78 103.74,19.94 103.11,20.57 IC3(1).2 | R3.1 C34.2 C33.2 34.65,7.49 35.16,6.86 36.17,6.86 D1.C v36.3,4.95
  Bottom 0.305: v36.3,4.95 37.95,4.95 42.02,9.02 55.99,9.02 58.53,11.56 60.56,11.56 63.48,14.48 77.32,14.48 77.96,13.84 79.35,13.84 79.99,14.48 95.99,14.48 98.02,16.51 99.29,16.51 100.69,14.99 v105.52,14.99
A-S1  (via drill 0.61)
  Top 0.279: RN4.7 114.9,22.62 115.93,21.59 115.93,20.95 118.22,18.67 124.18,18.67 S1.P$3 128.07,22.16 v129.39,20.83 | S1.P$4 138.09,12.52 138.03,12.57
  Top 0.305: v138.03,19.05 138.03,12.57 | v112.37,18.29 110.6,20.07 108.06,20.07 106.02,22.1 106.02,23.62 106.02,24.51 106.02,24.89 105.16,25.75 104.35,25.75 103.74,25.15 103.71,25.12 IC3(1).9
  Bottom 0.305: v138.03,19.05 137.01,19.05 135.11,20.95 129.52,20.95 v129.39,20.83 126.73,18.16 115.93,18.16 115.42,18.67 112.76,18.67 v112.37,18.29
A-S2  (via drill 0.61)
  Top 0.279: 117.23,26.72 S2.P$1 117.35,26.67 117.33,26.67
  Top 0.305: v127.49,31.75 127.49,36.58 S2.P$2 | v117.33,29.97 117.33,27.05 S2.P$1 | 117.33,26.67 v117.33,21.34 115.24,23.43 RN4.8 | IC3(1).8 104.67,24.47 v104.75,24.51
  Bottom 0.305: v117.33,29.97 121.9,29.97 123.68,31.75 v127.49,31.75 | v104.75,24.51 104.75,23.88 104.75,23.62 104.75,21.97 105.39,21.34 106.41,21.34 107.29,20.45 109.83,20.45 110.34,20.95 116.18,20.95 116.57,21.34 v117.33,21.34
A-S3  (via drill 0.61)
  Top 0.279: RN4.5 114.46,21.02 114.66,20.83 114.66,18.16 113.64,17.14 111.87,17.14 109.71,19.3 107.68,19.3 104.75,22.23 104.75,22.73 103.67,23.82 IC3(1).7 | S3.P$4 131.42,47.24 | 141.71,37.72 141.71,37.46 S3.P$3
  Top 0.305: v128.5,47.37 131.04,47.37 131.42,47.24 | v141.71,47.24 141.71,37.72 | v105.64,45.21 104.25,43.81 102.6,43.81 100.94,42.16 100.94,32.64 99.93,31.62 99.93,25.15 101.25,23.82 IC3(1).7
  Bottom 0.305: v141.71,47.24 v128.5,47.37 107.04,47.37 106.53,46.86 106.53,46.1 v105.64,45.21
A-S4  (via drill 0.61)
  Top 0.279: RN4.6 114.81,21.82 115.3,21.34 115.3,17.91 113.9,16.51 111.49,16.51 109.33,18.67 v105.9,18.67 | S4.P$3 142.52,22.94 142.6,22.86 | S4.P$4 152.63,33.15
  Top 0.305: v105.9,18.67 105.9,19.94 105.14,20.7 104.12,21.72 103.99,21.84 103.99,22.35 103.17,23.17 IC3(1).6 | 142.6,22.86 v142.6,20.57 | v152.63,20.57 152.63,33.15
  Bottom 0.305: v105.9,18.67 110.6,18.67 111.36,19.43 115.8,19.43 116.18,19.05 125.71,19.05 128.63,21.97 135.49,21.97 136.89,20.57 v142.6,20.57 v152.63,20.57
A-TEMP  (via drill 0.61)
  Top 0.305: C12.2 v78.72,15.24 R10.1 IC2.2 | IC3(1).3 101.59,21.22 101.2,20.83 v101.2,18.92
  Bottom 0.305: v78.72,15.24 95.61,15.24 99.29,18.92 v101.2,18.92
AREF
  Top 0.279: U2.42 87.97,41.38 89.01,42.42 89.39,42.42 90.53,43.56 C17.2
AVCC  (via drill 0.61)
  Top 0.279: v86.85,43.31 85.7,43.31 85.32,42.93 85.32,42.41 U2.44 | U2.24 80.02,35.59 79.1,34.67
  Top 0.305: 79.1,34.67 78.85,34.16 | 95.99,49.53 96.63,49.53 97.77,48.39 97.77,48.13 C15.1
  Top 0.406: 78.85,34.16 v78.47,33.78 | v98.28,34.04 98.28,35.31 97.13,36.45 v97.13,40.26 97.13,43.81 98.4,45.09 C15.1 | L1.2 95.99,49.53
  Bottom 0.279: 74.91,32.38 75.49,32.97 77.65,32.97
  Bottom 0.406: v86.85,43.31 91.04,43.31 93.71,40.64 95.74,40.64 96.12,40.26 v97.13,40.26 | 88.5,34.92 88.5,34.04 87.23,32.77 86.59,32.77 84.56,30.73 75.67,30.73 74.91,31.5 74.91,32.38 | 88.5,34.92 88.88,35.31 | 88.88,35.31 97.01,35.31 v98.28,34.04 | 77.65,32.97 v78.47,33.78 | 88.5,34.92 88.88,35.31
BUZZ-CMD  (via drill 0.61)
  Top 0.305: U2.27 81.52,33.92 v81.39,33.78 | v61.96,34.04 61.7,33.78 52.94,33.78 52.3,34.42 50.27,34.42 49.26,35.43 R12.2 R17.2
  Bottom 0.279: 77.32,35.31 76.05,34.04 66.91,34.04 v61.96,34.04
  Bottom 0.305: 77.32,35.31 79.86,35.31 v81.39,33.78
BUZZ-COM
  Top 0.279: SG1(2).+ 46.01,54.69 46.84,53.85 46.84,51.52 SG1(1).+
  Top 0.305: SG1(1).+ 46.84,51.27 46.84,46.99 44.68,44.83 R15.1 42.91,41.02 R16.2 42.65,41.15 43.92,39.88 45.45,39.88 46.33,39.88 46.97,39.88 47.22,39.62 R17.1
D7/LCD_CS  (via drill 0.61)
  Top 0.279: U2.1 84.53,43.53 86.97,45.97
  Top 0.305: 86.97,45.97 86.97,46.1 87.86,46.99 90.78,46.99 91.55,46.23 93.96,46.23 v94.21,45.97
  Bottom 0.305: LCD1.5 110.22,35.05 110.85,35.69 110.85,42.93 109.83,43.94 107.55,43.94 106.53,42.93 104.75,42.93 103.23,44.45 99.29,44.45 98.91,44.83 95.36,44.83 v94.21,45.97
D+
  Top 0.406: Z1.1 78.47,53.21 81.89,53.21 | 81.89,53.21 81.02,53.21 | 81.89,53.21 82.02,54.1 J1.P3 | 81.89,53.21 81.89,52.26 RN2.7
D-
  Top 0.381: 82.68,54.2 83.48,53.16 RN2.5
  Top 0.406: 86.09,53.21 86.09,53.09 83.53,53.09 83.48,53.16 | J1.P2 82.68,54.2
  Top 0.61: Z2.1 86.09,53.21
G-SEL
  Top 0.305: IC4.10 81.62,27.73 81.11,27.22 78.25,27.22 75.67,24.64 SJ1.2 R6.1
GND  (via drill 0.6, 0.61)
  Top 0.203: 95.38,23.82 93.88,23.82 93.78,23.93 | 93.81,25.78 95.48,25.78 | 102.85,27.05 102.21,27.05 IC3(1).12
  Top 0.254: 79.53,36.61 79.53,36.14 79.02,35.64 | 79.53,36.63 79.53,36.61 | 79.53,36.61 U2.23 | 85.22,37.87 U2.35 | 85.32,37.87 85.78,37.87 87.03,37.74 | 38.59,12.37 40.54,12.37 40.8,12.12 | 82.53,43.18 82.53,45.21 82.66,45.34 82.66,45.97
  Top 0.279: U2.5 82.52,41.78 | 82.52,41.78 82.52,40.89 | 82.52,40.89 82.52,40.38 U2.EXP 82.02,37.85 | U2.15 82.51,40.88 82.52,40.89 | 82.52,41.78 82.62,41.88 U2.43 86.43,41.88 86.72,42.16 | 82.02,37.85 82.05,37.88 U2.35 85.32,37.87 | 80.12,37.85 82.02,37.85 | IC4.5 80.82,30.92 80.37,31.37 79.35,31.37 79.1,31.11
  Top 0.305: U2.23 79.52,37.25 80.12,37.85 | 82.62,41.88 83.58,41.88 v83.8,41.66
  Top 0.406: 63.1,22.1 64.37,22.1 | J1.P5 80.7,54.69 80.37,54.36
  other vias: 90.28,50.55 88.5,50.55 84.69,50.04 79.86,51.94 101.2,52.96 145.78,29.97 134.85,40.64 134.85,19.3 124.19,29.97 19.28,51.56 112.25,6.86 44.43,51.44 41.76,10.92 80.62,24.77 86.21,24.77 116.06,24.51 116.18,16.64 100.82,46.86 105.64,48.01 63.99,42.8 63.99,39.88 103.87,33.4 93.83,33.4
  pour Bottom (isolate 0.406, rank 2): 165.08,60.96 -2.56,60.96 -2.56,-2.54 165.08,-2.54
  pour Top (isolate 0.406, rank 2): -4.59,60.45 168.13,59.94 167.87,0.25 -5.1,0.25
HWB
  Top 0.279: U2.33 85.8,36.6 86.92,35.49 86.92,33.71 88.46,32.17 RN1.1
INA  (via drill 0.61)
  Top 0.305: v100.18,50.67 100.18,47.88 99.42,47.12 99.42,44.83 98.4,43.81 98.4,36.58 99.42,35.56 99.42,33.4 98.28,32.26 98.28,30.73 96.75,29.21 96.75,27.3 97.64,26.42 97.64,22.1 97.26,21.72 97.26,20.95 96.88,20.57 IC3(1).23 | v94.47,51.94 94.47,54.74 93.96,55.24 INA.2
  Bottom 0.305: v94.47,51.94 98.91,51.94 v100.18,50.67
INB
  Top 0.305: INB.2 104.63,55.24 103.61,54.23 100.69,54.23 97.9,51.44 95.74,51.44 94.72,50.42 94.72,48.9 95.1,48.51 96.5,48.51 97.01,48.01 97.01,47.12 97.39,46.74 97.39,45.34 95.74,43.69 95.74,39.62 96.12,39.24 96.12,36.2 96.88,35.43 96.88,33.53 97.39,33.02 97.39,30.99 96.12,29.72 96.12,26.67 96.88,25.91 96.88,22.48 96.5,22.1 96.5,21.46 96.26,21.22 IC3(1).22
IO8/CARD_CS  (via drill 0.61)
  Top 0.279: U2.28 82.02,34.54 88.12,28.45
  Top 0.305: 88.12,28.45 v88.12,27.43
  Top 0.406: v103.87,28.96 107.42,32.51 LCD1.6
  Bottom 0.305: v88.12,27.43 89.39,26.16 98.66,26.16 101.45,28.96 v103.87,28.96
IO11/DC_LCD  (via drill 0.61)
  Top 0.279: U2.20 77.47,38.38 v76.69,37.59
  Bottom 0.279: 86.34,44.83 85.83,44.32 80.62,44.32 80.12,43.81 76.43,43.81 75.93,43.43 75.93,42.16 76.43,41.66 76.43,38.73 76.69,38.48 v76.69,37.59 | 90.66,44.83 93.96,41.53 97.77,41.53 98.15,41.15 101.71,41.15 104.75,38.1 104.75,36.2 107.04,33.91 107.04,30.35 107.42,29.97
  Bottom 0.305: 86.34,44.83 88.5,44.83 89.51,44.83 89.77,44.83 90.15,44.83 90.66,44.83
  Bottom 0.406: 107.42,29.97 LCD1.7
IO13  (via drill 0.61)
  Top 0.279: U2.32 84.02,36.05 85.02,35.05 v85.7,35.05
  Top 0.305: v32.24,43.94 32.24,49.02 31.84,49.42 RN3.2
  Bottom 0.279: 76.89,35.89 75.6,34.59 67.85,34.59 66.88,35.56 66.78,35.56
  Bottom 0.305: v32.24,43.94 50.65,44.07 53.45,46.86 56.24,46.86 57.89,45.21 57.89,41.4 63.73,35.56 66.78,35.56 | v85.7,35.05 81.51,35.05 80.68,35.89 76.89,35.89 | 66.78,35.56 66.88,35.56 66.78,35.56
J-SW  (via drill 0.61)
  Top 0.305: v51.03,18.29 50.27,19.05 50.27,24.38 49.89,24.77 C27.2 v46.46,24.77 | IC3(1).21 93.73,21.87 92.82,20.95 v92.82,19.81
  Top 0.406: R14.2 91.8,18.8 v92.82,19.81
  Bottom 0.305: v46.46,24.77 19.28,24.77 P1.B1A | v92.82,19.81 91.93,19.81 86.09,19.81 84.94,20.95 76.56,20.95 73.89,18.29 v51.03,18.29
J-XOUT  (via drill 0.61)
  Top 0.305: C29.2 25.38,10.03 29.95,14.61 P1.V2 | IC3(1).20 91.97,22.52 v91.29,21.84
  Bottom 0.305: P1.V2 29.95,21.08 30.59,21.72 34.52,21.72 35.79,20.45 37.57,20.45 37.7,20.57 52.94,20.57 53.7,19.81 73.13,19.81 76.31,22.99 87.99,22.99 89.13,24.13 90.4,24.13 91.29,23.24 v91.29,21.84
J-YOUT  (via drill 0.61)
  Top 0.305: v46.46,29.97 C28.2 51.16,29.97 51.54,29.59 51.54,23.37 51.16,22.99 51.16,20.45 v52.18,19.43 | IC3(1).19 90.33,23.17 v89.9,22.86
  Bottom 0.305: P1.H2 v46.46,29.97 | v89.9,22.86 89.13,22.86 88.24,21.97 76.43,21.97 73.51,19.05 52.56,19.05 v52.18,19.43
LED-B
  Top 0.279: U2.29 82.53,34.92 87.67,29.79 RN1.4
LED-G
  Top 0.279: U2.30 83.02,35.32 87.76,30.59 RN1.3
LED-R
  Top 0.279: U2.31 83.52,35.71 87.84,31.39 RN1.2
MISO  (via drill 0.61)
  Top 0.279: v73.64,47.37 74.27,46.74 74.27,44.7 75.16,43.81 79.23,43.81 79.52,43.52 U2.11
  Bottom 0.305: 104.5,42.04 102.85,43.69 99.04,43.69 98.66,44.07 94.47,44.07 92.56,45.97 91.04,47.5 88.37,47.5 85.83,47.5 85.07,46.74 84.05,46.74 83.8,46.99 77.83,46.99 77.7,46.86 76.31,46.86 76.18,46.99 74.02,46.99 v73.64,47.37 70.34,47.37 69.96,47.75 ICSP.1
  Bottom 0.406: 104.5,42.04 106.91,42.04 107.55,42.67 LCD1.2
MOSI  (via drill 0.61)
  Top 0.254: 63.99,49.02 v63.99,44.83
  Top 0.279: U2.10 80.02,43.83 79.41,44.45 77.2,44.45 v76.69,44.96
  Top 0.305: ICSP.4 63.99,49.02
  Bottom 0.305: v63.99,44.83 67.29,44.83 67.92,45.47 75.42,45.47 75.8,45.09 76.56,45.09 v76.69,44.96 77.2,44.45 79.48,44.45 80.24,45.21 85.7,45.21 86.21,45.72 87.36,45.72 89.9,45.72 90.78,45.72 93.96,42.55 97.77,42.55 98.15,42.16 101.96,42.16 106.53,37.59 107.55,37.59
  Bottom 0.406: 107.17,37.59 107.55,37.59 LCD1.4
MUXA  (via drill 0.61)
  Top 0.279: U2.36 87.13,38.38 88.88,37.85 v90.15,36.58
  Top 0.305: v102.21,36.32 101.71,35.81 101.71,32.26 100.69,31.24 100.69,28.96 100.69,26.54 101.46,25.77 IC3(1).10
  Bottom 0.279: v90.15,36.58 90.53,36.2 95.74,36.2 95.86,36.32 v102.21,36.32
MUXB  (via drill 0.61)
  Top 0.279: U2.37 87.47,38.88 89.39,38.48 v90.15,38.23 | v102.21,38.1 103.48,36.83 103.48,35.69 102.47,34.67 102.47,31.88 101.58,30.99 101.58,29.59 101.33,29.34 101.33,26.8 101.7,26.42 IC3(1).11
  Bottom 0.279: v90.15,38.23 90.78,38.23 91.93,37.08 95.36,37.08 95.48,37.21 101.33,37.21 101.71,37.59 v102.21,38.1
MUXC
  Top 0.279: U2.38 89.27,39.38 89.77,39.37 90.66,39.37 91.55,38.48 91.55,38.1 95.1,34.54 95.1,32.89 95.61,32.38 95.61,31.5 94.59,30.48 94.59,28.57 93.58,27.56 93.58,26.8 93.96,26.42 IC3(1).14
MUXD
  Top 0.279: 94.59,36.45 90.91,40.13 89.77,40.13 89.51,39.88 U2.39
  Top 0.305: 94.45,27.07 IC3(1).13 95.12,27.07 95.36,27.3 95.36,30.1 96.5,31.24 96.5,32.64 95.99,33.15 95.99,35.05 94.59,36.45
N$1
  Top 0.305: 38.59,13.66 36.89,13.66 36.3,13.08 D1.A 36.3,9.91 | 38.59,13.66 39.17,13.66 IC1.2 | IC1.1 38.67,14.31 38.59,14.22 38.59,13.66
N$2
  Top 0.305: RN3.7 31.84,52.31 L.A
N$3
  Top 0.305: RN3.8 31.09,51.44 30.33,52.2 29.7,52.2 28.17,53.72 27.41,53.72 ON.A
N$4  (via drill 0.61)
  Top 0.305: IC4.13 84.02,27.4 83.55,26.92 82.02,26.92 81.51,26.42 80.37,26.42 v78.72,24.77 | v70.97,24.77 R13.2 v70.97,24.77
  Top 0.406: SJ2.2 R13.2
  Bottom 0.305: v78.72,24.77 v70.97,24.77
N$5
  Top 0.305: R15.2 46.25,41.02 T1.3
N$6
  Top 0.305: RN3.6 32.64,52.31 TX.A
N$8
  Top 0.305: RN3.5 33.38,51.44 34.14,52.2 34.78,52.2 36.3,53.72 37.32,53.72 RX.A
N$11  (via drill 0.61)
  Top 0.279: RN1.7 91.18,31.39
  Top 0.305: 91.18,31.39 v91.67,31.88 | v82.53,24.77 83.8,23.5 84.43,23.5 85.7,22.23 85.7,21.34 85.7,20.32 85.7,8.26 v89.64,4.32 | v110.22,10.92 110.22,9.03 LED1.1
  Bottom 0.305: v91.67,31.88 89.51,31.88 88.63,30.99 87.74,30.99 86.72,29.97 86.72,28.7 84.82,26.8 84.56,26.8 v82.53,24.77 | v89.64,4.32 92.05,4.32 93.71,5.97 100.94,5.97 101.83,5.08 108.44,5.08 110.22,6.86 v110.22,10.92
N$12  (via drill 0.61)
  Top 0.279: RN1.6 91.18,30.59 v91.67,30.1
  Top 0.305: v84.31,24.77 86.59,22.48 86.59,20.95 86.59,19.94 86.59,9.91 v89.64,6.86 | v108.18,6.86 LED1.2
  Bottom 0.305: v89.64,6.86 101.33,6.86 102.21,5.97 107.17,5.97 108.06,6.86 v108.18,6.86 | v91.67,30.1 88.12,30.1 87.48,29.46 87.48,28.45 85.45,26.42 85.45,25.91 v84.31,24.77
N$13  (via drill 0.61)
  Top 0.279: RN1.5 90.32,28.49 v90.28,28.45
  Top 0.305: v97.9,28.45 97.9,27.43 98.4,26.92 98.4,21.72 98.02,21.34 98.02,17.27 98.66,16.64 v98.66,15.24 | v107.42,10.92 107.42,8.76 106.41,7.75 106.41,5.33 107.17,4.57 110.09,4.57 LED1.3
  Bottom 0.305: v107.42,10.92 106.15,12.19 105.14,12.19 103.23,14.1 99.8,14.1 v98.66,15.24 | v90.28,28.45 v97.9,28.45
N$19  (via drill 0.61)
  Top 0.305: R2.2 C35.1 v41.76,4.95
  Bottom 0.305: v41.76,4.95 50.27,4.95 MIC1.1
N$20
  Top 0.305: C35.2 R4.1 44.3,10.79 43.92,11.18 43.92,12.32 IC1.5
N$21
  Top 0.305: R5.1 R1.1 46.39,13.01 IC1.6
N$23
  Top 0.305: IC1.3 39.52,13.01 42.17,13.01 42.83,13.66 IC1.7 45.01,13.66 46.21,14.86 R1.2
N$27
  Top 0.305: R8.2 118.47,45.34 119.87,46.74 PH1(1).1
  Top 0.406: PH1(2).1 PH1(3).1 118.86,50.87 PH1(1).1
N$31
  Top 0.305: R12.1 49.26,41.13 T1.1
OUT2  (via drill 0.61)
  Top 0.279: v60.18,44.83 60.18,54.61 59.42,55.37 OUT2.2 | U2.12 77.49,42.38 v77.07,42.8
  Bottom 0.279: 71.99,36.2 72.37,36.58 74.15,36.58 74.4,36.83 75.54,36.83 75.93,36.45 77.32,36.45 77.7,36.83 77.7,38.61 77.07,39.24 v77.07,42.8 | 64.11,37.47 60.18,41.4 v60.18,44.83
  Bottom 0.305: 71.99,36.2 68.31,36.2 67.42,37.08 64.5,37.08 64.11,37.47
OUT3  (via drill 0.61)
  Top 0.279: U2.18 76.82,39.38 75.54,38.1 v74.66,38.1
  Top 0.305: v66.53,38.35 66.53,43.43 67.92,44.83 67.92,47.12 67.67,47.37 67.67,51.05 69.07,52.45 69.07,53.85 70.08,54.86 OUT3.2
  Bottom 0.305: v74.66,38.1 74.02,37.47 71.99,37.47 71.73,37.21 68.43,37.21 67.29,38.35 v66.53,38.35
RD+
  Top 0.279: U2.4 83.02,44.72 83.42,45.21 | 81.84,50.86 81.85,50.86 RN2.2
  Top 0.305: 83.42,45.21 83.42,46.35 82.66,47.12 82.66,49.4 81.89,50.16 81.89,50.8 81.84,50.86
RD-
  Top 0.279: U2.3 83.52,44.43 84.18,45.09
  Top 0.305: 84.18,45.09 84.18,46.61 83.47,47.32 83.47,48.18 83.48,49.71 RN2.4
RESET  (via drill 0.61)
  Top 0.279: U2.13 77.8,41.88 77.67,41.75 76.26,41.75 75.6,42.42 75.42,42.42 74.66,43.18 74.02,43.18 73.39,43.81 73.39,45.72 72.5,46.61 72.5,48.01 72.62,48.13 72.62,49.53 71.73,50.42 v71.73,51.31 R7.2
  Top 0.305: TS42.2 15.22,49.15 v19.28,49.15 23.22,49.15 TS42.1 | v49.76,57.15 v49.76,46.23
  Bottom 0.305: v71.73,51.31 66.78,51.31 ICSP.5 65.77,53.34 65.77,55.88 64.75,56.9 64.75,57.78 63.61,58.93 51.54,58.93 v49.76,57.15 | v49.76,46.23 22.2,46.23 v19.28,49.15
RST_LCD  (via drill 0.61)
  Top 0.279: U2.21 78.12,37.88 77.83,37.59 77.83,37.08 77.2,36.45 75.93,36.45 75.54,36.83 73.64,36.83 73.51,36.7
  Top 0.305: 73.51,36.7 71.61,34.8 v71.61,31.5
  Bottom 0.305: v71.61,31.5 71.61,31.24 73,29.84 84.94,29.84 86.85,31.75 87.48,31.75 88.88,33.15 92.18,33.15 93.71,31.62 100.44,31.62 101.45,31.62 103.99,31.62 105.77,29.84 105.77,28.45 106.79,27.43
  Bottom 0.406: 106.79,27.43 LCD1.8
RXLED  (via drill 0.61)
  Top 0.279: U2.8 81.02,44.71 79.25,46.48 77.58,46.48 77.2,46.86 76.31,46.86 75.54,47.62 v75.54,49.28
  Top 0.305: RX.C 38.68,55.79 v38.71,55.75
  Bottom 0.279: v75.54,49.28 75.04,49.78 70.34,49.78 69.58,49.02 64.5,49.02 63.99,48.51 63.99,46.99 63.48,46.48 59.03,46.48 56.88,48.64 53.83,48.64 49.76,52.7 49,52.7
  Bottom 0.305: 49,52.7 40.37,52.7 38.71,54.36 v38.71,55.75
SCK  (via drill 0.61)
  Top 0.279: U2.9 80.52,44.27 79.33,45.47 v78.59,45.47
  Top 0.305: ICSP.3 66.27,50.29 66.78,49.78 v66.78,46.23
  Bottom 0.305: 105.26,40.13 102.47,42.93 98.66,42.93 98.28,43.31 94.21,43.31 91.67,45.85 90.91,46.61 87.86,46.61 86.09,46.61 85.45,45.97 83.42,45.97 83.29,46.1 79.23,46.1 v78.59,45.47 78.08,45.97 76.05,45.97 75.8,46.23 v66.78,46.23
  Bottom 0.406: 105.26,40.13 LCD1.3
TXLED  (via drill 0.61)
  Top 0.254: U2.22 78.63,37.38
  Top 0.279: 78.63,37.38 78.63,36.62 77.83,35.81 77.07,35.81
  Top 0.305: 77.07,35.81 75.29,35.81 v75.04,35.69 | TX.C 35.25,55.79 v35.29,55.75
  Bottom 0.279: 63.86,36.58 58.65,41.78 58.65,45.59 56.49,47.75 53.32,47.75 51.03,50.04 43.41,50.04 39.22,50.04
  Bottom 0.305: 39.22,50.04 35.29,53.98 v35.29,55.75 | v75.04,35.69 74.15,35.69 73.89,35.43 68.05,35.43 67.16,36.32 64.11,36.32 63.86,36.58
UCAP
  Top 0.279: U2.6 82.02,45.59 81.26,46.35 80.75,46.86 C16.1
USH  (via drill 0.61)
  Top 0.813: L2.2 76.18,54.36 77.58,55.75 79.43,55.75
  other vias: 77.7,55.75 86.34,55.75 82.02,57.53
  pour Top (isolate 0.406): 77.2,61.98 86.85,61.98 86.85,55.24 77.2,55.24
  pour Bottom (isolate 0.406): 77.2,61.98 86.85,61.98 86.85,55.24 77.2,55.24
XOUT  (via drill 0.6, 0.61)
  Top 0.279: IC4.2 83.22,31.18 83.54,31.5 84.18,31.5 85.7,29.97 85.7,29.59 | C21.2 87.99,25.65 85.7,27.94 v85.7,29.08 | U2.41 88.48,40.88 89.26,41.66 90.28,41.66 v90.66,42.04
  Top 0.305: v85.7,29.08 85.7,29.59
  Bottom 0.279: 77.65,34.75 76.41,33.5 71.33,33.5 71.1,33.27
  Bottom 0.305: v85.7,29.08 85.58,29.21 72.24,29.21 70.46,30.99 70.46,32.64 71.1,33.27 | 77.65,34.75 79.02,34.75 81.01,32.77 85.45,32.77 87.23,34.54 87.23,35.18 86.47,35.94 86.47,37.47 86.85,37.85 86.85,38.23 89.77,41.15 90.4,41.78 v90.66,42.04
XTAL1
  Top 0.279: U2.17 76.18,39.88 75.67,39.37 73.39,39.37
  Top 0.305: R9.1 73.39,39.37 73.39,38.61 72.12,37.34 C11.1 71.23,37.47 70.97,37.72 69.45,39.24 Y1.1
XTAL2
  Top 0.279: U2.16 75.3,40.38 R9.2
  Top 0.305: 71.61,41.53 71.23,41.66 | 71.23,41.66 C10.2 | 71.61,41.53 Y1.3 71.61,41.15 71.61,41.53 | 71.23,41.66 74.02,41.66 75.04,40.64 R9.2
XUSB
  Top 0.381: 83.34,54.69 83.55,54.61
  Top 0.406: J1.P1 83.34,54.69
  Top 0.61: F1.2 88.71,52.5 87.1,54.48 85.45,54.48 84.94,54.36 84.05,54.36 83.55,54.61
YOUT  (via drill 0.61)
  Top 0.279: U2.26 81.02,35.07 80.37,34.42 80.37,33.15 81.01,32.51 81.51,32.51 v82.28,31.75 82.42,31.6 IC4.3
  Top 0.305: C20.2 v76.56,32
  Bottom 0.305: v76.56,32 77.2,32 77.45,31.75 v82.28,31.75
ZOUT
  Top 0.279: U2.25 80.52,35.33 79.74,34.54 79.74,32.89 | 79.74,32.89 81.62,31.01 IC4.4 | C19.2 76.05,29.46 79.23,32.64 79.48,32.64 79.74,32.89

### Text on the board
Bottom: 2012-REV06
tPlace: Prototype | Limited | Edition | BUZZER | LIGHT | RESET | ACCEL | Y | SELF-T | Z | X | 6g | 1.5 | TEMP | MICRO | LED
tNames: 1 | TM | Arduino | Esplora | arduino.org
bNames: MADE IN | ITALY